# Altium schematic sheet Misc Circuits.SchDoc
size A4; Organization: Altium Limited; Address1: L3, 12a Rodborough Rd; Address2: Frenchs Forest; Address3: NSW; Address4: Australia 2086
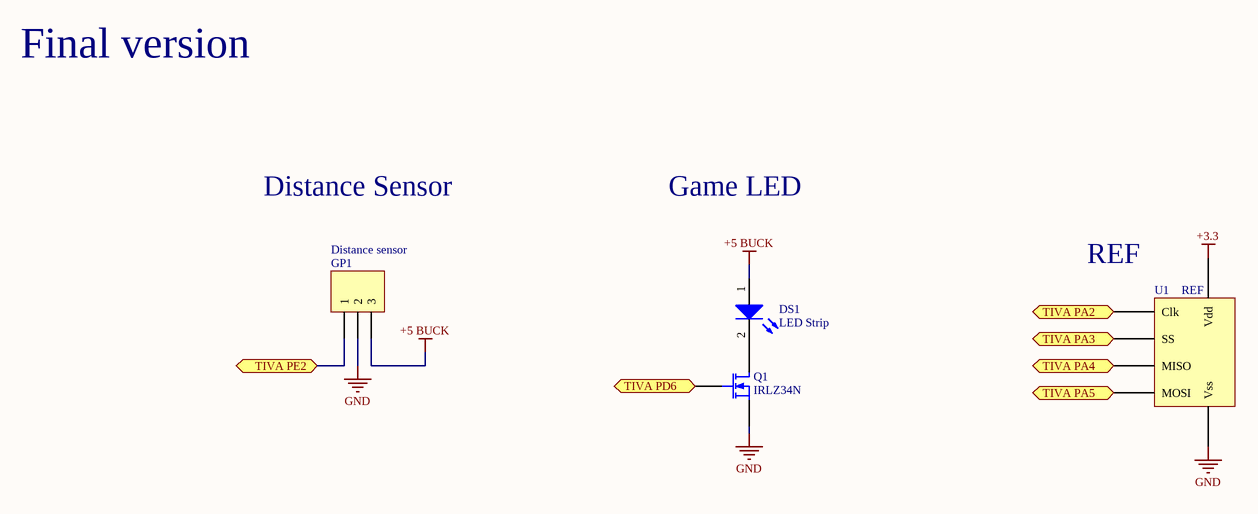
[diagram p0: Misc Circuits.SchDoc]

## Parts
DS1  LED Strip  [LED-0]
GP1  Distance sensor  [HDR1X3]
Q1  IRLZ34N  [BCY-W3/H.8]
U1  REF

## Ports
TIVA PA2, TIVA PA3, TIVA PA4, TIVA PA5, TIVA PD6, TIVA PE2

## Nets
+3.3: U1.?1(Vdd)
+5 BUCK: DS1.1(A) GP1.3
GND: GP1.2 Q1.3(S) U1.?2(Vss)
TIVA PA2: U1.?3(Clk) ; port TIVA PA2
TIVA PA3: U1.?4(SS) ; port TIVA PA3
TIVA PA4: U1.?5(MISO) ; port TIVA PA4
TIVA PA5: U1.?6(MOSI) ; port TIVA PA5
TIVA PD6: Q1.2(G) ; port TIVA PD6
TIVA PE2: GP1.1 ; port TIVA PE2
NetDS1_2: DS1.2(K) Q1.1(D)

## Notes on the sheet
- Final version
- Distance Sensor
- Game LED
- (near U1) REF
- Title
- Size:
- Date:
- A4
- Number:
- Time:
- Revision:
- Sheet
- of
- File:

## Library data of the parts
DS1 = LED0: Typical INFRARED GaAs LED; Manufacturer: Generic Components; Class: Optoelectronic; Published: 08/06/2000; Publisher: Altium Hobart Technology Centre; SubClass: LED
GP1 = Molex3: Header, 3-Pin; Manufacturer: Generic Components; Class: Connector
Q1 = MOSFET-N: N-Channel MOSFET; Manufacturer: Generic Components; Class: Discrete; SubClass: MOSFET - Low Power; Published: 08/06/2000; Publisher: Altium Hobart Technology Centre